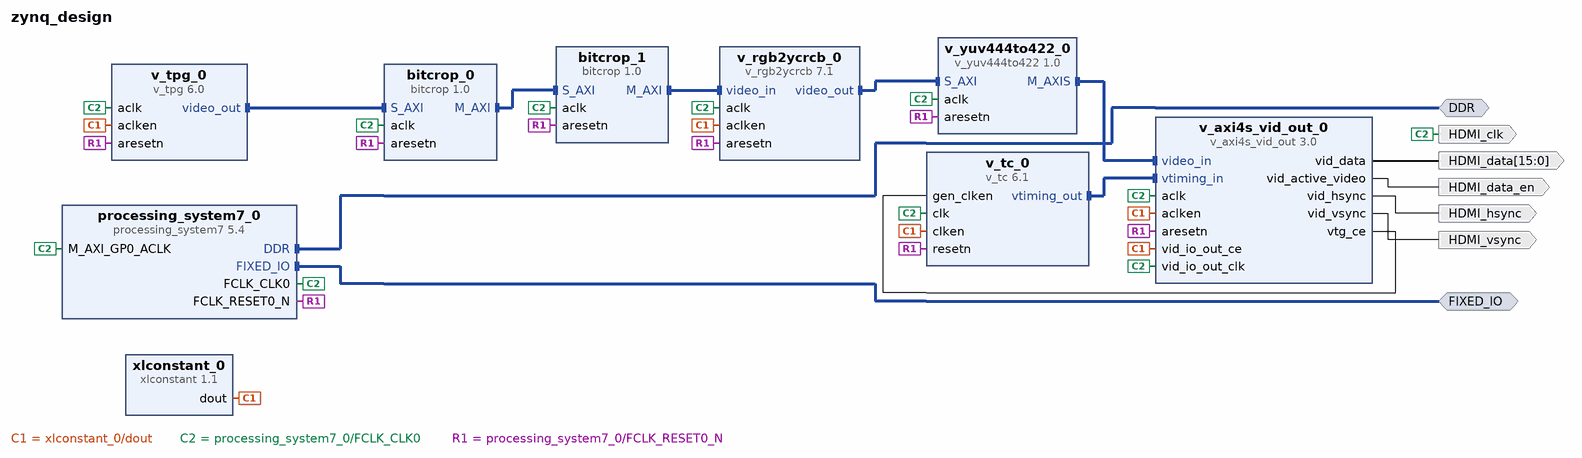
[diagram p0: block diagram of the top level]
# Vivado block design zynq_design, Vivado 2014.2
create_bd_design zynq_design

create_bd_intf_port -mode Master -vlnv xilinx.com:interface:ddrx_rtl:1.0 DDR
create_bd_intf_port -mode Master -vlnv xilinx.com:display_processing_system7:fixedio_rtl:1.0 FIXED_IO
create_bd_port -dir O -type clk HDMI_clk
create_bd_port -dir O -from 15 -to 0 HDMI_data
create_bd_port -dir O HDMI_data_en
create_bd_port -dir O HDMI_hsync
create_bd_port -dir O HDMI_vsync

create_bd_cell -type ip -vlnv xilinx.com:ip:processing_system7:5.4 processing_system7_0
set_property -dict {CONFIG.preset {ZedBoard*}} [get_bd_cells processing_system7_0]
create_bd_cell -type ip -vlnv xilinx.com:ip:v_tpg:6.0 v_tpg_0
set_property -dict {CONFIG.has_axi4_lite false CONFIG.pattern_control 9 CONFIG.m_video_format 2} [get_bd_cells v_tpg_0]
create_bd_cell -type ip -vlnv xilinx.com:user:bitcrop:1.0 bitcrop_0
set_property -dict {CONFIG.C_S_AXI_TDATA_WIDTH 24} [get_bd_cells bitcrop_0]
create_bd_cell -type ip -vlnv xilinx.com:user:bitcrop:1.0 bitcrop_1
set_property -dict {CONFIG.C_S_AXI_TDATA_WIDTH 32 CONFIG.C_M_AXI_TDATA_WIDTH 24} [get_bd_cells bitcrop_1]
create_bd_cell -type ip -vlnv xilinx.com:ip:v_rgb2ycrcb:7.1 v_rgb2ycrcb_0
set_property -dict [list \
  CONFIG.Standard_Sel HD_ITU_709__1125_NTSC \
  CONFIG.Output_Range 0_to_255_for_Computer_Graphics \
] [get_bd_cells v_rgb2ycrcb_0]
create_bd_cell -type ip -vlnv jsykora.info:user:v_yuv444to422:1.0 v_yuv444to422_0
create_bd_cell -type ip -vlnv xilinx.com:ip:v_axi4s_vid_out:3.0 v_axi4s_vid_out_0
set_property -dict {CONFIG.C_S_AXIS_VIDEO_FORMAT 0} [get_bd_cells v_axi4s_vid_out_0]
create_bd_cell -type ip -vlnv xilinx.com:ip:v_tc:6.1 v_tc_0
set_property -dict {CONFIG.HAS_AXI4_LITE false CONFIG.VIDEO_MODE 1080p CONFIG.enable_detection false} [get_bd_cells v_tc_0]
create_bd_cell -type ip -vlnv xilinx.com:ip:xlconstant:1.1 xlconstant_0

# ---- connections ----

connect_bd_intf_net [get_bd_intf_pins v_tpg_0/video_out] [get_bd_intf_pins bitcrop_0/S_AXI]
connect_bd_intf_net [get_bd_intf_pins v_rgb2ycrcb_0/video_in] [get_bd_intf_pins bitcrop_1/M_AXI]
connect_bd_intf_net [get_bd_intf_pins v_rgb2ycrcb_0/video_out] [get_bd_intf_pins v_yuv444to422_0/S_AXI]
connect_bd_intf_net [get_bd_intf_pins v_axi4s_vid_out_0/video_in] [get_bd_intf_pins v_yuv444to422_0/M_AXIS]
connect_bd_intf_net [get_bd_intf_pins v_tc_0/vtiming_out] [get_bd_intf_pins v_axi4s_vid_out_0/vtiming_in]
connect_bd_intf_net [get_bd_intf_pins bitcrop_1/S_AXI] [get_bd_intf_pins bitcrop_0/M_AXI]
connect_bd_intf_net [get_bd_intf_ports DDR] [get_bd_intf_pins processing_system7_0/DDR]
connect_bd_intf_net [get_bd_intf_ports FIXED_IO] [get_bd_intf_pins processing_system7_0/FIXED_IO]
connect_bd_net [get_bd_pins xlconstant_0/dout] \
  [get_bd_pins v_tpg_0/aclken] [get_bd_pins v_tc_0/clken] [get_bd_pins v_rgb2ycrcb_0/aclken] \
  [get_bd_pins v_axi4s_vid_out_0/vid_io_out_ce] [get_bd_pins v_axi4s_vid_out_0/aclken]
connect_bd_net [get_bd_pins processing_system7_0/FCLK_CLK0] \
  [get_bd_ports HDMI_clk] [get_bd_pins v_tpg_0/aclk] [get_bd_pins bitcrop_0/aclk] [get_bd_pins v_tc_0/clk] \
  [get_bd_pins bitcrop_1/aclk] [get_bd_pins v_rgb2ycrcb_0/aclk] [get_bd_pins v_yuv444to422_0/aclk] \
  [get_bd_pins v_axi4s_vid_out_0/aclk] [get_bd_pins v_axi4s_vid_out_0/vid_io_out_clk] \
  [get_bd_pins processing_system7_0/M_AXI_GP0_ACLK]
connect_bd_net [get_bd_pins processing_system7_0/FCLK_RESET0_N] \
  [get_bd_pins v_tpg_0/aresetn] [get_bd_pins bitcrop_0/aresetn] [get_bd_pins v_tc_0/resetn] [get_bd_pins bitcrop_1/aresetn] \
  [get_bd_pins v_rgb2ycrcb_0/aresetn] [get_bd_pins v_yuv444to422_0/aresetn] [get_bd_pins v_axi4s_vid_out_0/aresetn]
connect_bd_net [get_bd_pins v_axi4s_vid_out_0/vid_data] [get_bd_ports HDMI_data]
connect_bd_net [get_bd_pins v_axi4s_vid_out_0/vid_active_video] [get_bd_ports HDMI_data_en]
connect_bd_net [get_bd_pins v_axi4s_vid_out_0/vid_hsync] [get_bd_ports HDMI_hsync]
connect_bd_net [get_bd_pins v_axi4s_vid_out_0/vid_vsync] [get_bd_ports HDMI_vsync]
connect_bd_net [get_bd_pins v_axi4s_vid_out_0/vtg_ce] [get_bd_pins v_tc_0/gen_clken]

validate_bd_design
save_bd_design
